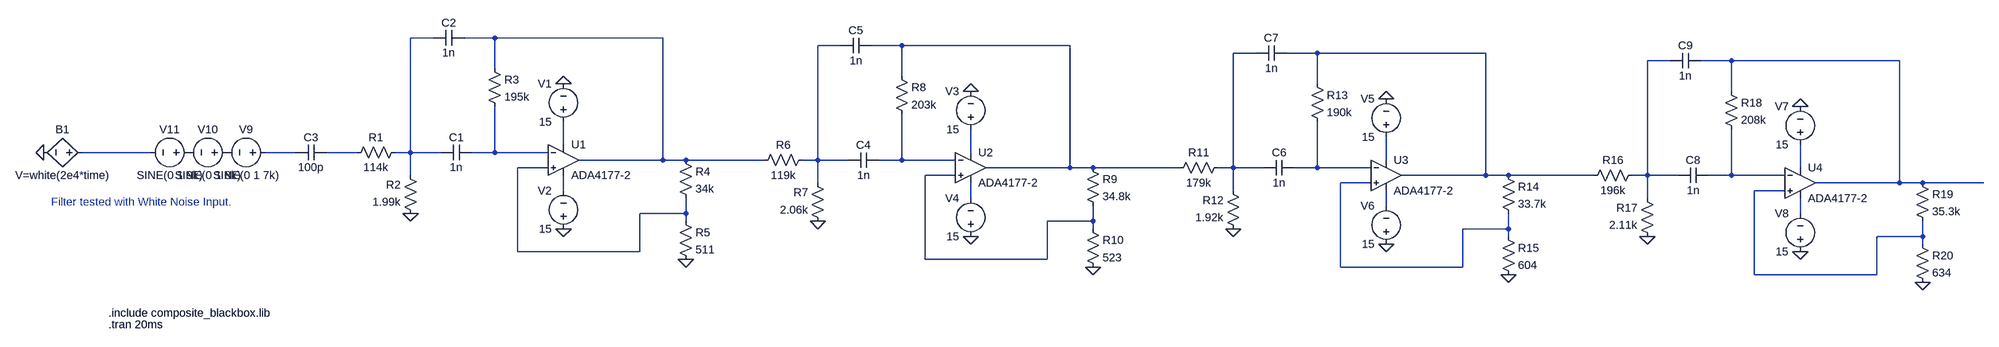
[diagram p0: schematic HackathonFinalSchem8kHz.asc]
HackathonFinalSchem8kHz.asc, the LTspice schematic file:
Version 4.1
SHEET 1 880 680
WIRE -3488 -592 -3536 -592
WIRE -3360 -592 -3424 -592
WIRE -3008 -592 -3360 -592
WIRE -2576 -576 -2624 -576
WIRE -2448 -576 -2512 -576
WIRE -2096 -576 -2448 -576
WIRE -1680 -560 -1728 -560
WIRE -1552 -560 -1616 -560
WIRE -1200 -560 -1552 -560
WIRE -752 -544 -800 -544
WIRE -624 -544 -688 -544
WIRE -272 -544 -624 -544
WIRE -3360 -528 -3360 -592
WIRE -2448 -512 -2448 -576
WIRE -1552 -496 -1552 -560
WIRE -624 -480 -624 -544
WIRE -3216 -368 -3216 -416
WIRE -4080 -352 -4224 -352
WIRE -3776 -352 -3840 -352
WIRE -3648 -352 -3712 -352
WIRE -3536 -352 -3536 -592
WIRE -3536 -352 -3568 -352
WIRE -3472 -352 -3536 -352
WIRE -3360 -352 -3360 -448
WIRE -3360 -352 -3408 -352
WIRE -3248 -352 -3360 -352
WIRE -2304 -352 -2304 -400
WIRE -3008 -336 -3008 -592
WIRE -3008 -336 -3184 -336
WIRE -2960 -336 -3008 -336
WIRE -2736 -336 -2960 -336
WIRE -2624 -336 -2624 -576
WIRE -2624 -336 -2656 -336
WIRE -2560 -336 -2624 -336
WIRE -2448 -336 -2448 -432
WIRE -2448 -336 -2496 -336
WIRE -2336 -336 -2448 -336
WIRE -1408 -336 -1408 -384
WIRE -3248 -320 -3312 -320
WIRE -2096 -320 -2096 -576
WIRE -2096 -320 -2272 -320
WIRE -2048 -320 -2096 -320
WIRE -1840 -320 -2048 -320
WIRE -1728 -320 -1728 -560
WIRE -1728 -320 -1760 -320
WIRE -1664 -320 -1728 -320
WIRE -1552 -320 -1552 -416
WIRE -1552 -320 -1600 -320
WIRE -1440 -320 -1552 -320
WIRE -480 -320 -480 -368
WIRE -3536 -304 -3536 -352
WIRE -2336 -304 -2400 -304
WIRE -1200 -304 -1200 -560
WIRE -1200 -304 -1376 -304
WIRE -1152 -304 -1200 -304
WIRE -912 -304 -1152 -304
WIRE -800 -304 -800 -544
WIRE -800 -304 -832 -304
WIRE -736 -304 -800 -304
WIRE -624 -304 -624 -400
WIRE -624 -304 -672 -304
WIRE -512 -304 -624 -304
WIRE -2624 -288 -2624 -336
WIRE -1440 -288 -1504 -288
WIRE -272 -288 -272 -544
WIRE -272 -288 -448 -288
WIRE -224 -288 -272 -288
WIRE -96 -288 -224 -288
WIRE -3216 -272 -3216 -304
WIRE -1728 -272 -1728 -320
WIRE -512 -272 -576 -272
WIRE -2304 -256 -2304 -288
WIRE -800 -256 -800 -304
WIRE -1408 -240 -1408 -272
WIRE -2960 -224 -2960 -256
WIRE -2960 -224 -3056 -224
WIRE -480 -224 -480 -256
WIRE -2960 -208 -2960 -224
WIRE -2048 -208 -2048 -240
WIRE -2048 -208 -2144 -208
WIRE -2048 -192 -2048 -208
WIRE -1152 -192 -1152 -224
WIRE -1152 -192 -1248 -192
WIRE -1152 -176 -1152 -192
WIRE -224 -176 -224 -208
WIRE -224 -176 -320 -176
WIRE -224 -160 -224 -176
WIRE -3312 -144 -3312 -320
WIRE -3056 -144 -3056 -224
WIRE -3056 -144 -3312 -144
WIRE -2400 -128 -2400 -304
WIRE -2144 -128 -2144 -208
WIRE -2144 -128 -2400 -128
WIRE -1504 -112 -1504 -288
WIRE -1248 -112 -1248 -192
WIRE -1248 -112 -1504 -112
WIRE -576 -96 -576 -272
WIRE -320 -96 -320 -176
WIRE -320 -96 -576 -96
FLAG -2960 -128 0
FLAG -3536 -224 0
FLAG -3216 -192 0
FLAG -3216 -496 0
FLAG -2048 -112 0
FLAG -2624 -208 0
FLAG -2304 -176 0
FLAG -2304 -480 0
FLAG -1152 -96 0
FLAG -1728 -192 0
FLAG -1408 -160 0
FLAG -1408 -464 0
FLAG -224 -80 0
FLAG -800 -176 0
FLAG -480 -144 0
FLAG -480 -448 0
FLAG -4304 -352 0
SYMBOL res -3552 -368 R90
WINDOW 0 0 56 VBottom 2
WINDOW 3 32 56 VTop 2
SYMATTR InstName R1
SYMATTR Value 114k
SYMBOL res -3520 -208 R180
WINDOW 0 36 76 Left 2
WINDOW 3 36 40 Left 2
SYMATTR InstName R2
SYMATTR Value 1.99k
SYMBOL cap -3472 -336 R270
WINDOW 0 32 32 VTop 2
WINDOW 3 0 32 VBottom 2
SYMATTR InstName C1
SYMATTR Value 1n
SYMBOL cap -3488 -576 R270
WINDOW 0 32 32 VTop 2
WINDOW 3 0 32 VBottom 2
SYMATTR InstName C2
SYMATTR Value 1n
SYMBOL res -3376 -544 R0
SYMATTR InstName R3
SYMATTR Value 195k
SYMBOL res -2976 -352 R0
SYMATTR InstName R4
SYMATTR Value 34k
SYMBOL res -2976 -224 R0
SYMATTR InstName R5
SYMATTR Value 511
SYMBOL voltage -3216 -400 R180
WINDOW 0 24 96 Left 2
WINDOW 3 24 16 Left 2
WINDOW 123 0 0 Left 0
WINDOW 39 0 0 Left 0
SYMATTR InstName V1
SYMATTR Value 15
SYMBOL voltage -3216 -176 R180
WINDOW 0 24 96 Left 2
WINDOW 3 24 16 Left 2
WINDOW 123 0 0 Left 0
WINDOW 39 0 0 Left 0
SYMATTR InstName V2
SYMATTR Value 15
SYMBOL cap -3712 -368 R90
WINDOW 0 0 32 VBottom 2
WINDOW 3 32 32 VTop 2
SYMATTR InstName C3
SYMATTR Value 100p
SYMBOL res -2640 -352 R90
WINDOW 0 0 56 VBottom 2
WINDOW 3 32 56 VTop 2
SYMATTR InstName R6
SYMATTR Value 119k
SYMBOL res -2608 -192 R180
WINDOW 0 36 76 Left 2
WINDOW 3 36 40 Left 2
SYMATTR InstName R7
SYMATTR Value 2.06k
SYMBOL cap -2560 -320 R270
WINDOW 0 32 32 VTop 2
WINDOW 3 0 32 VBottom 2
SYMATTR InstName C4
SYMATTR Value 1n
SYMBOL cap -2576 -560 R270
WINDOW 0 32 32 VTop 2
WINDOW 3 0 32 VBottom 2
SYMATTR InstName C5
SYMATTR Value 1n
SYMBOL res -2464 -528 R0
SYMATTR InstName R8
SYMATTR Value 203k
SYMBOL res -2064 -336 R0
SYMATTR InstName R9
SYMATTR Value 34.8k
SYMBOL res -2064 -208 R0
SYMATTR InstName R10
SYMATTR Value 523
SYMBOL voltage -2304 -384 R180
WINDOW 0 24 96 Left 2
WINDOW 3 24 16 Left 2
WINDOW 123 0 0 Left 0
WINDOW 39 0 0 Left 0
SYMATTR InstName V3
SYMATTR Value 15
SYMBOL voltage -2304 -160 R180
WINDOW 0 24 96 Left 2
WINDOW 3 24 16 Left 2
WINDOW 123 0 0 Left 0
WINDOW 39 0 0 Left 0
SYMATTR InstName V4
SYMATTR Value 15
SYMBOL res -1744 -336 R90
WINDOW 0 0 56 VBottom 2
WINDOW 3 32 56 VTop 2
SYMATTR InstName R11
SYMATTR Value 179k
SYMBOL res -1712 -176 R180
WINDOW 0 36 76 Left 2
WINDOW 3 36 40 Left 2
SYMATTR InstName R12
SYMATTR Value 1.92k
SYMBOL cap -1664 -304 R270
WINDOW 0 32 32 VTop 2
WINDOW 3 0 32 VBottom 2
SYMATTR InstName C6
SYMATTR Value 1n
SYMBOL cap -1680 -544 R270
WINDOW 0 32 32 VTop 2
WINDOW 3 0 32 VBottom 2
SYMATTR InstName C7
SYMATTR Value 1n
SYMBOL res -1568 -512 R0
SYMATTR InstName R13
SYMATTR Value 190k
SYMBOL res -1168 -320 R0
SYMATTR InstName R14
SYMATTR Value 33.7k
SYMBOL res -1168 -192 R0
SYMATTR InstName R15
SYMATTR Value 604
SYMBOL voltage -1408 -368 R180
WINDOW 0 24 96 Left 2
WINDOW 3 24 16 Left 2
WINDOW 123 0 0 Left 0
WINDOW 39 0 0 Left 0
SYMATTR InstName V5
SYMATTR Value 15
SYMBOL voltage -1408 -144 R180
WINDOW 0 24 96 Left 2
WINDOW 3 24 16 Left 2
WINDOW 123 0 0 Left 0
WINDOW 39 0 0 Left 0
SYMATTR InstName V6
SYMATTR Value 15
SYMBOL res -816 -320 R90
WINDOW 0 0 56 VBottom 2
WINDOW 3 32 56 VTop 2
SYMATTR InstName R16
SYMATTR Value 196k
SYMBOL res -784 -160 R180
WINDOW 0 36 76 Left 2
WINDOW 3 36 40 Left 2
SYMATTR InstName R17
SYMATTR Value 2.11k
SYMBOL cap -736 -288 R270
WINDOW 0 32 32 VTop 2
WINDOW 3 0 32 VBottom 2
SYMATTR InstName C8
SYMATTR Value 1n
SYMBOL cap -752 -528 R270
WINDOW 0 32 32 VTop 2
WINDOW 3 0 32 VBottom 2
SYMATTR InstName C9
SYMATTR Value 1n
SYMBOL res -640 -496 R0
SYMATTR InstName R18
SYMATTR Value 208k
SYMBOL res -240 -304 R0
SYMATTR InstName R19
SYMATTR Value 35.3k
SYMBOL res -240 -176 R0
SYMATTR InstName R20
SYMATTR Value 634
SYMBOL voltage -480 -352 R180
WINDOW 0 24 96 Left 2
WINDOW 3 24 16 Left 2
WINDOW 123 0 0 Left 0
WINDOW 39 0 0 Left 0
SYMATTR InstName V7
SYMATTR Value 15
SYMBOL voltage -480 -128 R180
WINDOW 0 24 96 Left 2
WINDOW 3 24 16 Left 2
WINDOW 123 0 0 Left 0
WINDOW 39 0 0 Left 0
SYMATTR InstName V8
SYMATTR Value 15
SYMBOL voltage -3824 -352 R90
WINDOW 0 -32 56 VBottom 2
WINDOW 3 32 56 VTop 2
WINDOW 123 0 0 Left 0
WINDOW 39 0 0 Left 0
SYMATTR InstName V9
SYMATTR Value SINE(0 1 7k)
SYMBOL voltage -3904 -352 R90
WINDOW 0 -32 56 VBottom 2
WINDOW 3 32 56 VTop 2
WINDOW 123 0 0 Left 0
WINDOW 39 0 0 Left 0
SYMATTR InstName V10
SYMATTR Value SINE(0 1 8k)
SYMBOL voltage -3984 -352 R90
WINDOW 0 -32 56 VBottom 2
WINDOW 3 32 56 VTop 2
WINDOW 123 0 0 Left 0
WINDOW 39 0 0 Left 0
SYMATTR InstName V11
SYMATTR Value SINE(0 1 9k)
SYMBOL bv -4208 -352 R90
WINDOW 0 -32 56 VBottom 2
WINDOW 3 32 56 VTop 2
SYMATTR InstName B1
SYMATTR Value V=white(2e4*time)
SYMBOL OpAmps\\ADA4177-2 -3216 -336 R0
SYMATTR InstName U1
SYMBOL OpAmps\\ADA4177-2 -2304 -320 R0
SYMATTR InstName U2
SYMBOL OpAmps\\ADA4177-2 -1408 -304 R0
SYMATTR InstName U3
SYMBOL OpAmps\\ADA4177-2 -480 -288 R0
SYMATTR InstName U4
TEXT -4168 -16 Left 2 !.include composite_blackbox.lib
TEXT -4168 8 Left 2 !.tran 20ms
TEXT -4288 -248 Left 2 ;Filter tested with White Noise Input.

The netlist it stands for:
* HackathonFinalSchem8kHz.asc
R1 N001 N012 114k
R2 0 N001 1.99k
C1 N001 N013 1n
C2 N001 N002 1n
R3 N002 N013 195k
R4 N002 N017 34k
R5 N017 0 511
V1 N009 0 15
V2 0 N023 15
C3 N012 N011 100p
R6 N003 N002 119k
R7 0 N003 2.06k
C4 N003 N015 1n
C5 N003 N004 1n
R8 N004 N015 203k
R9 N004 N020 34.8k
R10 N020 0 523
V3 N014 0 15
V4 0 N025 15
R11 N005 N004 179k
R12 0 N005 1.92k
C6 N005 N018 1n
C7 N005 N006 1n
R13 N006 N018 190k
R14 N006 N022 33.7k
R15 N022 0 604
V5 N016 0 15
V6 0 N026 15
R16 N007 N006 196k
R17 0 N007 2.11k
C8 N007 N021 1n
C9 N007 N008 1n
R18 N008 N021 208k
R19 N008 N024 35.3k
R20 N024 0 634
V7 N019 0 15
V8 0 N027 15
V9 N011 P001 SINE(0 1 7k)
V10 P001 P002 SINE(0 1 8k)
V11 P002 N010 SINE(0 1 9k)
B1 N010 0 V=white(2e4*time)
* U1: ADA4177-2 (symbol OpAmps\ADA4177-2 not available, pins judged from their places): In+=N017 In-=N013 V+=N009 V-=N023 OUT=N002
* U2: ADA4177-2 (symbol OpAmps\ADA4177-2 not available, pins judged from their places): In+=N020 In-=N015 V+=N014 V-=N025 OUT=N004
* U3: ADA4177-2 (symbol OpAmps\ADA4177-2 not available, pins judged from their places): In+=N022 In-=N018 V+=N016 V-=N026 OUT=N006
* U4: ADA4177-2 (symbol OpAmps\ADA4177-2 not available, pins judged from their places): In+=N024 In-=N021 V+=N019 V-=N027 OUT=N008
.include composite_blackbox.lib
.tran 20ms
* Filter tested with White Noise Input.
.backanno
.end